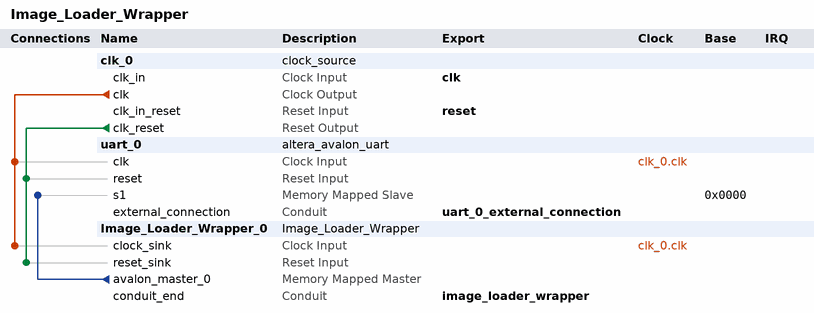
[diagram p0: system contents]
# Platform Designer (Qsys) system Image_Loader_Wrapper, Cyclone IV E EP4CE115F29C7
# Parameters at their usual value, and those the tool derives, are not listed.
package require -exact qsys 15.0
create_system Image_Loader_Wrapper
set_project_property DEVICE_FAMILY {Cyclone IV E}
set_project_property DEVICE EP4CE115F29C7

add_instance clk_0 clock_source 15.0
set_instance_parameter_value clk_0 clockFrequency 25000000

add_instance uart_0 altera_avalon_uart 15.0
set_instance_parameter_value uart_0 baud 115200
set_instance_parameter_value uart_0 dataBits 8
set_instance_parameter_value uart_0 fixedBaud true
set_instance_parameter_value uart_0 parity NONE
set_instance_parameter_value uart_0 stopBits 1

add_instance Image_Loader_Wrapper_0 Image_Loader_Wrapper 1.0

# connections
add_connection clk_0.clk Image_Loader_Wrapper_0.clock_sink clock
add_connection clk_0.clk uart_0.clk clock
add_connection clk_0.clk_reset Image_Loader_Wrapper_0.reset_sink reset
add_connection clk_0.clk_reset uart_0.reset reset
add_connection Image_Loader_Wrapper_0.avalon_master_0 uart_0.s1 avalon
set_connection_parameter_value Image_Loader_Wrapper_0.avalon_master_0/uart_0.s1 baseAddress 0x0000

# exported interfaces
add_interface clk clock sink
set_interface_property clk EXPORT_OF clk_0.clk_in
add_interface image_loader_wrapper conduit end
set_interface_property image_loader_wrapper EXPORT_OF Image_Loader_Wrapper_0.conduit_end
add_interface reset reset sink
set_interface_property reset EXPORT_OF clk_0.clk_in_reset
add_interface uart_0_external_connection conduit end
set_interface_property uart_0_external_connection EXPORT_OF uart_0.external_connection

set_interconnect_requirement {$system} qsys_mm.clockCrossingAdapter HANDSHAKE
set_interconnect_requirement {$system} qsys_mm.enableEccProtection FALSE
set_interconnect_requirement {$system} qsys_mm.insertDefaultSlave FALSE
set_interconnect_requirement {$system} qsys_mm.maxAdditionalLatency 1

save_system Image_Loader_Wrapper.qsys
